# Altium schematic sheet microcontroller-pinout-motor-controller.SchDoc
size A
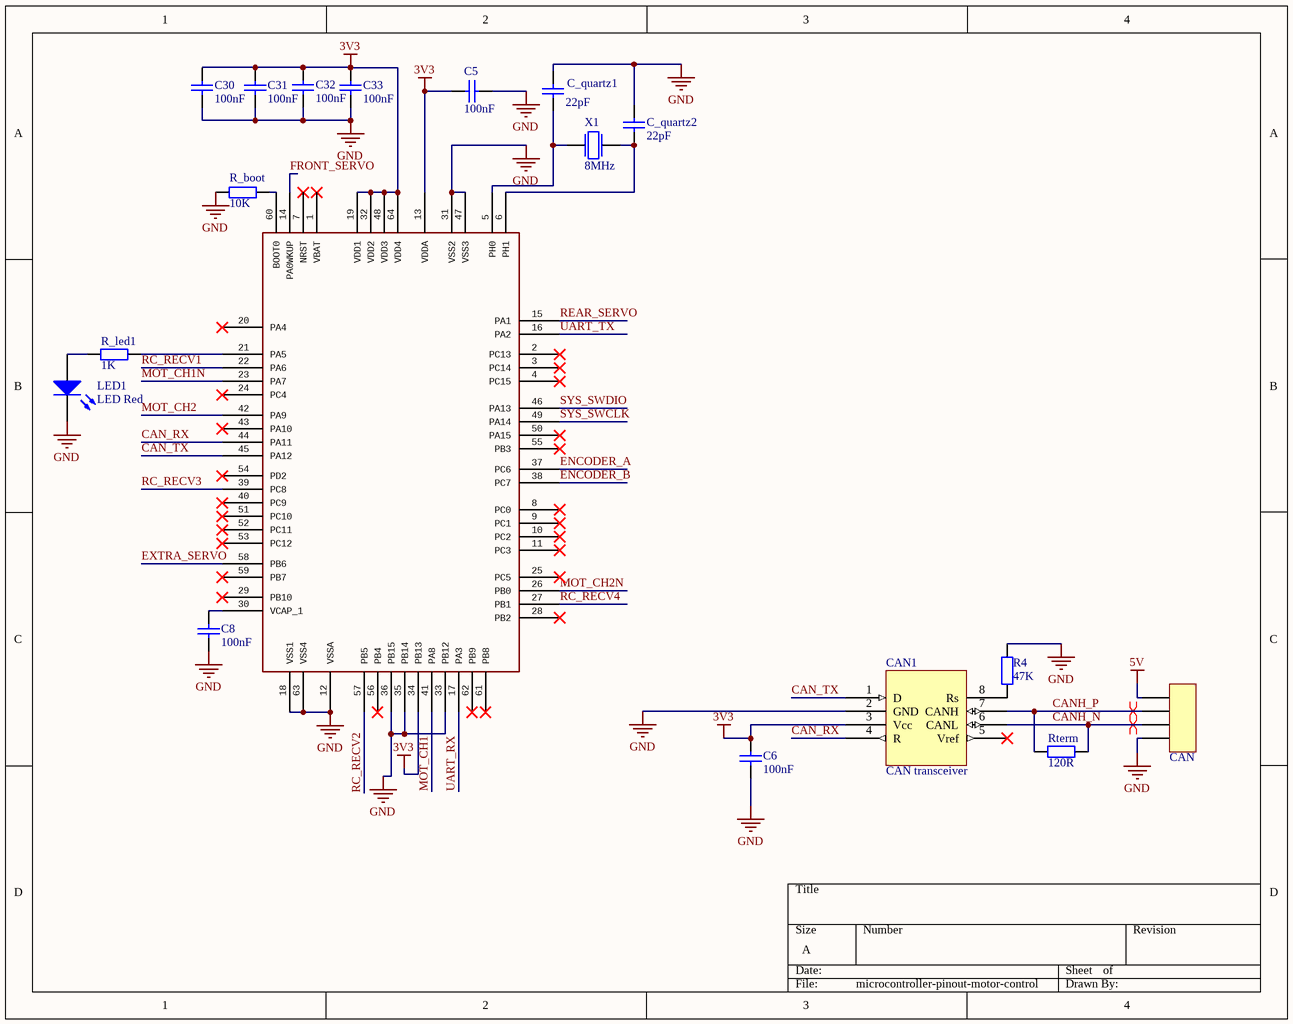
[diagram p0: microcontroller-pinout-motor-controller.SchDoc]

## Parts
1  64-pin STM32F4 chip with symbol for Foxcar Control Board v1.  [LQFP64]  (value not drawn)
C5  100nF  [FP_0805_CAP_085]
C6  100nF  [FP_0805_CAP_085]
C8  100nF  [FP_0805_CAP_085]
C30  100nF  [FP_0805_CAP_085]
C31  100nF  [FP_0805_CAP_085]
C32  100nF  [FP_0805_CAP_085]
C33  100nF  [FP_0805_CAP_085]
C_quartz1  22pF  [FP_0805_CAP_085]
C_quartz2  22pF  [FP_0805_CAP_085]
CAN  4-Pin Header  [4-Pin Header]  (value not drawn)
CAN1  CAN transceiver  [SOIC-8]
LED1  LED Red  [FP_0805_LED_RED]
R4  47K  [FP_0805_RES]
R_boot  10K  [FP_0805_RES]
R_led1  1K  [FP_0805_RES]
Rterm  120R  [FP_0805_RES]
X1  8MHz  [FP_CRYSTAL_HC49_SMD]

## Nets
3V3: 1.13(VDDA) 1.19(VDD1) 1.32(VDD2) 1.34(PB13) 1.48(VDD3) 1.64(VDD4) C5.2 C6.1 C30.2 C31.2 C32.2 C33.2 CAN1.3(Vcc)
5V: CAN.1
GND: 1.12(VSSA) 1.18(VSS1) 1.31(VSS2) 1.33(PB12) 1.35(PB14) 1.36(PB15) 1.47(VSS3) 1.63(VSS4) C5.1 C6.2 C8.1 C30.1 C31.1 C32.1 C33.1 C_quartz1.1 C_quartz2.1 CAN.4 CAN1.2(GND) LED1.2(K) R4.2 R_boot.1
CAN_RX: 1.44(PA11) CAN1.4(R)
CAN_TX: 1.45(PA12) CAN1.1(D)
CANH_N: CAN.3 CAN1.6(CANL) Rterm.2
CANH_P: CAN.2 CAN1.7(CANH) Rterm.1
ENCODER_A: 1.37(PC6)
ENCODER_B: 1.38(PC7)
EXTRA_SERVO: 1.58(PB6)
FRONT_SERVO: 1.14(PA0WKUP)
MOT_CH1: 1.41(PA8)
MOT_CH1N: 1.23(PA7)
MOT_CH2: 1.42(PA9)
MOT_CH2N: 1.26(PB0)
RC_RECV1: 1.22(PA6)
RC_RECV2: 1.57(PB5)
RC_RECV3: 1.39(PC8)
RC_RECV4: 1.27(PB1)
REAR_SERVO: 1.15(PA1)
SYS_SWCLK: 1.49(PA14)
SYS_SWDIO: 1.46(PA13)
UART_RX: 1.17(PA3)
UART_TX: 1.16(PA2)
Net1_5: 1.5(PH0) C_quartz1.2 X1.1
Net1_6: 1.6(PH1) C_quartz2.2 X1.2
Net1_21: 1.21(PA5) R_led1.1
Net1_30: 1.30(VCAP_1) C8.2
Net1_60: 1.60(BOOT0) R_boot.2
NetCAN1_8: CAN1.8(Rs) R4.1
NetLED1_1: LED1.1(A) R_led1.2

Not connected (* = marked no-connect by the designer): 1 1(VBAT)* 2(PC13)* 3(PC14)* 4(PC15)* 7(NRST)* 8(PC0)* 9(PC1)* 10(PC2)* 11(PC3)* 20(PA4)* 24(PC4)* 25(PC5)* 28(PB2)* 29(PB10)* 40(PC9)* 43(PA10)* 50(PA15)* 51(PC10)* 52(PC11)* 53(PC12)* 54(PD2)* 55(PB3)* 56(PB4)* 59(PB7)* 61(PB8)* 62(PB9)*; CAN1 5(Vref)*

## Layout directives
differential pair: CANH_N, CANH_P

## Library data of the parts
1 = STM32F4R_64PIN_FOXCAR: GateName_1: G$1; SymbolName_1: STM32F4_64PINS_FOXCARV1; LibraryName: stm32f4; DeviceSetName: STM32F4R_64PIN_FOXCAR; Package: LQFP64
C5 C6 C8 C30-C33 = CAP 100nF: Capacitor; Tolerance: +80%/-20%; Voltage: 25V; Reference: 1759167; Name: SMD Multilayer Ceramic Capacitor, 0805; Supplier: Farnell; Value: 100nF
C_quartz1 C_quartz2 = CAP 22pF: Capacitor; Tolerance: 5%; Voltage: 50V; Reference: 1759195; Name: SMD Multilayer Ceramic Capacitor, 0805; Supplier: Farnell; Value: 22pF
CAN1 = SN65HVD230
LED1 = LED Red: Red LED; pin to pad: 1>A 2>K; U_fw: 1.85V; I_max: 20mA; Reference: 1581239; Name: MULTICOMP  MCL-S270SRC  LED, Red, SMD, 1.25mm x 1.4mm, 20 mA, 1.85 V, 643 nm; Wavelength: 643nm; Supplier: Farnell
R4 = RES 47K: Resistor; Tolerance: 5%; Power: 125mW; Name: YAGEO (PHYCOMP)  RC0805JR-0747KL  SMD Chip Resistor, Thick Film, 47 kohm; Reference: 9234217; Supplier: Farnell; Value: 47K
R_boot = RES 10K: Resistor; Tolerance: 5%; Power: 125mW; Name: YAGEO (PHYCOMP)  RC0805JR-0710KL  SMD Chip Resistor, Thick Film, 10 kohm; Reference: 9234136; Supplier: Farnell; Value: 10K
R_led1 = RES 1K: Resistor; Tolerance: 5%; Power: 125mW; Name: YAGEO (PHYCOMP)  RC0805JR-071KL  SMD Chip Resistor, Thick Film, 1 kohm; Reference: 9234004; Supplier: Farnell; Value: 1K
Rterm = RES 120R: Resistor; Tolerance: 5%; Power: 125mW; Name: YAGEO (PHYCOMP)  RC0805JR-07120RL  SMD Chip Resistor, Thick Film, 120 ohm; Reference: 9233890; Supplier: Farnell; Value: 120R
X1 = Crystal: Quarz Crystal; Value: 8MHz